# Altium schematic sheet Sheet2.SchDoc
size A4; SheetNumber: 1; SheetTotal: 1
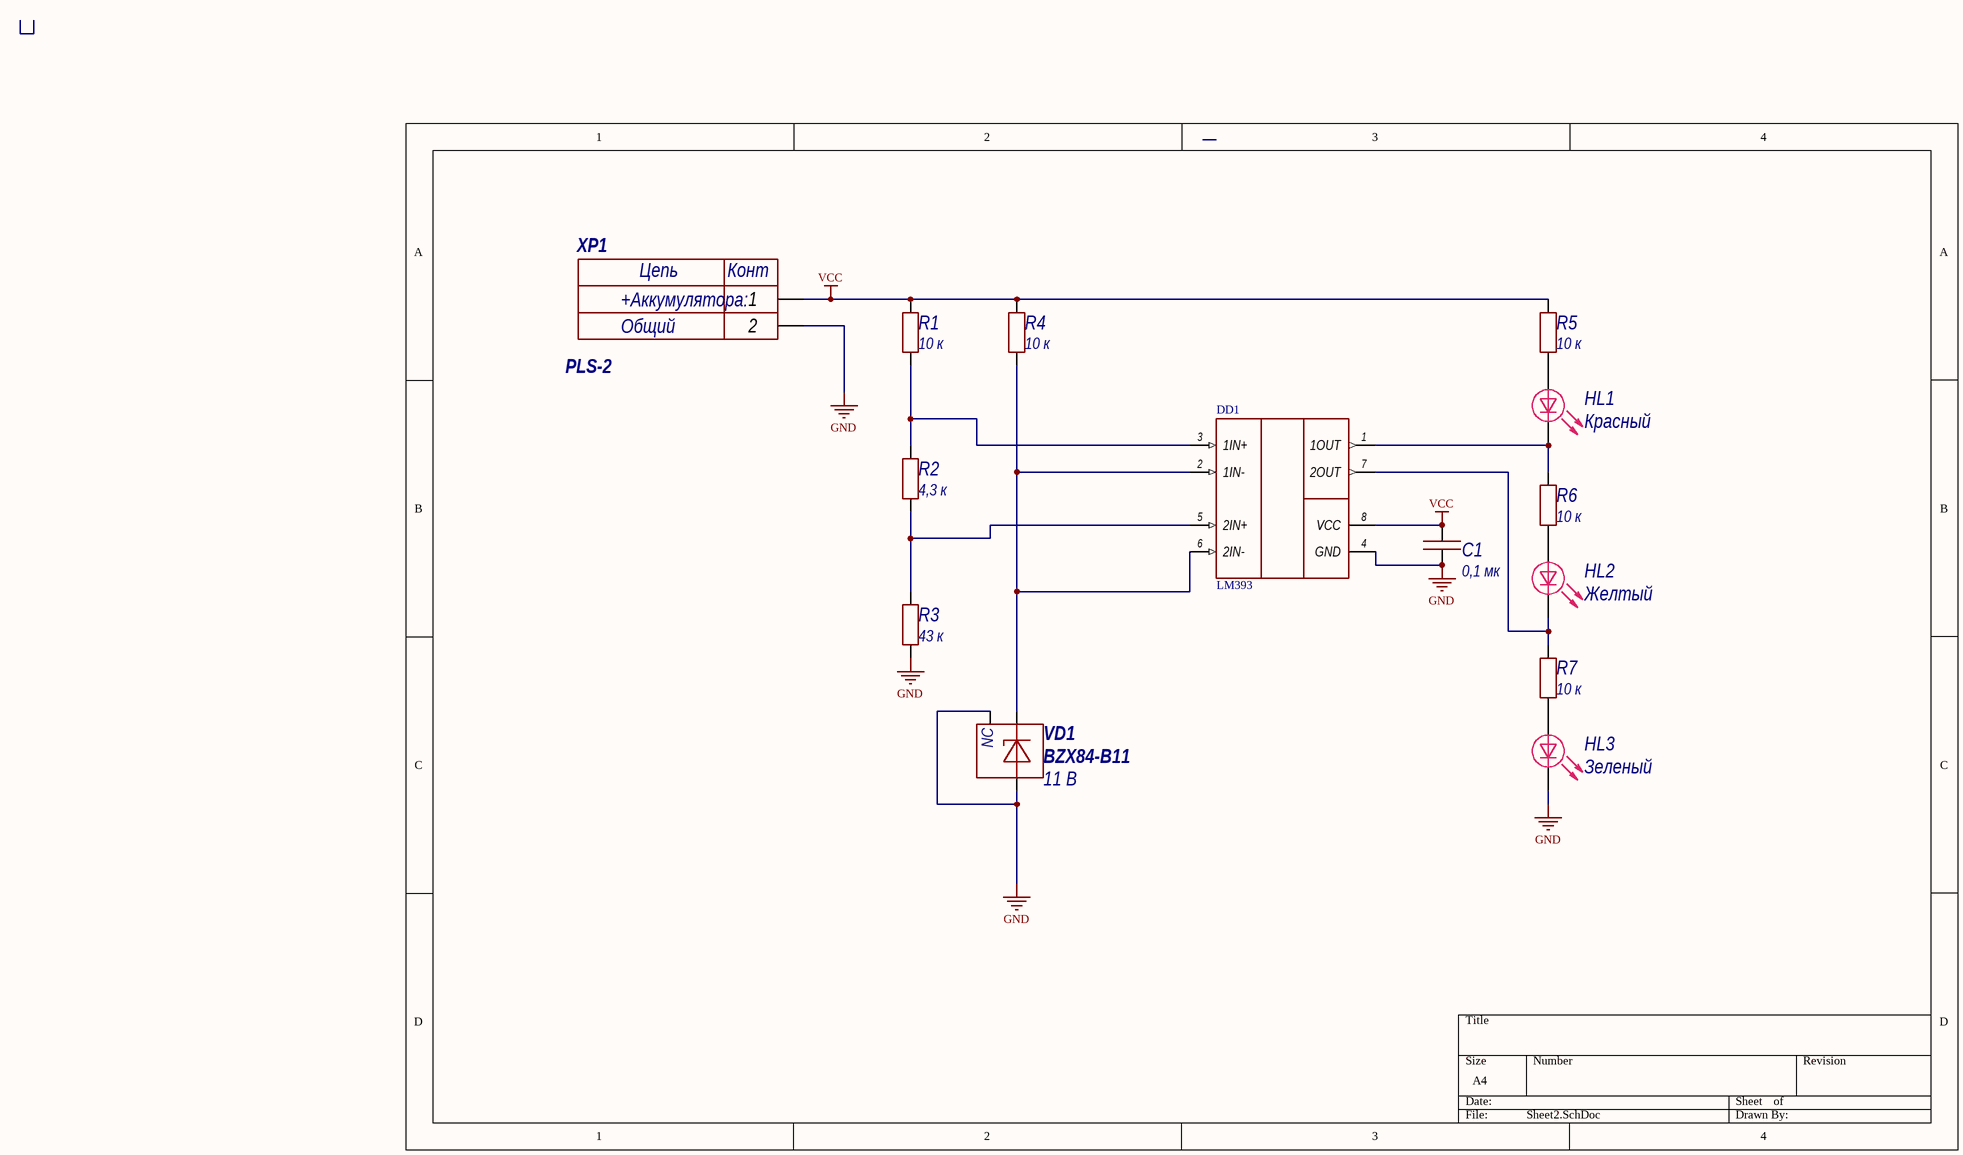
[diagram p0: Sheet2.SchDoc]

## Parts
C1  value 0,1 мк  [0603C]  (hidden comment: Capacitor)
DD1  LM393  [SOIC-8]
HL1  Color: Красный  [0805D]  (hidden comment: LED)
HL2  Color: Желтый  [0805D]  (hidden comment: LED)
HL3  Color: Зеленый  [0805D]  (hidden comment: LED)
R1  value 10 к  [0603R]  (hidden comment: Resistor)
R2  value 4,3 к  [0603R]  (hidden comment: Resistor)
R3  value 43 к  [0603R]  (hidden comment: Resistor)
R4  value 10 к  [0603R]  (hidden comment: Resistor)
R5  value 10 к  [0603R]  (hidden comment: Resistor)
R6  value 10 к  [0603R]  (hidden comment: Resistor)
R7  value 10 к  [0603R]  (hidden comment: Resistor)
VD1  BZX84-B11  value 11 В  [SOT23-3]
XP1  PLS-2  [PLS2]

## Nets
GND: C1.1 DD1.4(GND) HL3.2 R3.1 VD1.1 VD1.2 XP1.2
VCC: C1.2 DD1.8(VCC) R1.2 R4.2 R5.2 XP1.1
NetDD1_1: DD1.1(1OUT) HL1.2 R6.2
NetDD1_2: DD1.2(1IN-) DD1.6(2IN-) R4.1 VD1.3
NetDD1_3: DD1.3(1IN+) R1.1 R2.2
NetDD1_5: DD1.5(2IN+) R2.1 R3.2
NetDD1_7: DD1.7(2OUT) HL2.2 R7.2
NetHL1_1: HL1.1 R5.1
NetHL2_1: HL2.1 R6.1
NetHL3_1: HL3.1 R7.1

## Notes on the sheet
- (in symbol BZX84-B11) NC
- (in symbol PLS-2) Цепь; Конт

## Library data of the parts
C1 = Capacitor_0,1u_10_50V_X7R_0603C: Конденсатор 0603C ёмкостью 0,1 мк 10%, 50 В, X7R; Library Path2: Schematic\Capacitor.SchLib; Voltage (V): 50; Capacity (nF): 100; Part Number: Capacitor_0,1u_10_50V_X7R_0603C; Tolerance: 10%; Dielectric: X7R
DD1 = LM393: Двойной маломощный компаратор напряжения; MF: Texas Instruments; MP: LM393D; SnapEDA_Link: https://www.snapeda.com/parts/LM393D/Texas+Instruments/view-part/?ref=snap; Package: SOIC-8 Texas Instruments; Value: *; Check_prices: https://www.snapeda.com/parts/LM393D/Texas+Instruments/view-part/?ref=eda; Part Number: LM393
HL1-HL3 = LED: Светодиод; Part Number: LED
R1 = Resistor_10_1_0603: Резистор номиналом 10 Ом 1%; Power: *; Part Number: Resistor_10_1_0603; Tolerance: 1%
R2 R4 = Resistor_4.3_1_0603: Резистор номиналом 4,3 Ом 1%; Power: *; Part Number: Resistor_4.3_1_0603; Tolerance: 1%
R3 = Resistor_43k_1_0603: Резистор номиналом 43 кОм 1%; Power: *; Part Number: Resistor_43k_1_0603; Tolerance: 1%
R5-R7 = Resistor_10k_1_0603: Резистор номиналом 10 кОм 1%; Power: *; Part Number: Resistor_10k_1_0603; Tolerance: 1%
VD1 = BZX84-B11: Стабилитрон на 11 В, рассеиваемая мощность 0.25 Вт; Voltage nominal (V): 11; Current nominal (mA): 5; Power (W): 0.25; Accuracy: 0,02; Part Number: BZX84-B11
XP1 = PLS-2: Гребенка 2 пина; System: Connector; Общий: Общий; Part Number: PLS-2